# EAGLE schematic Schematic_v4 (EAGLE 9.7.0)
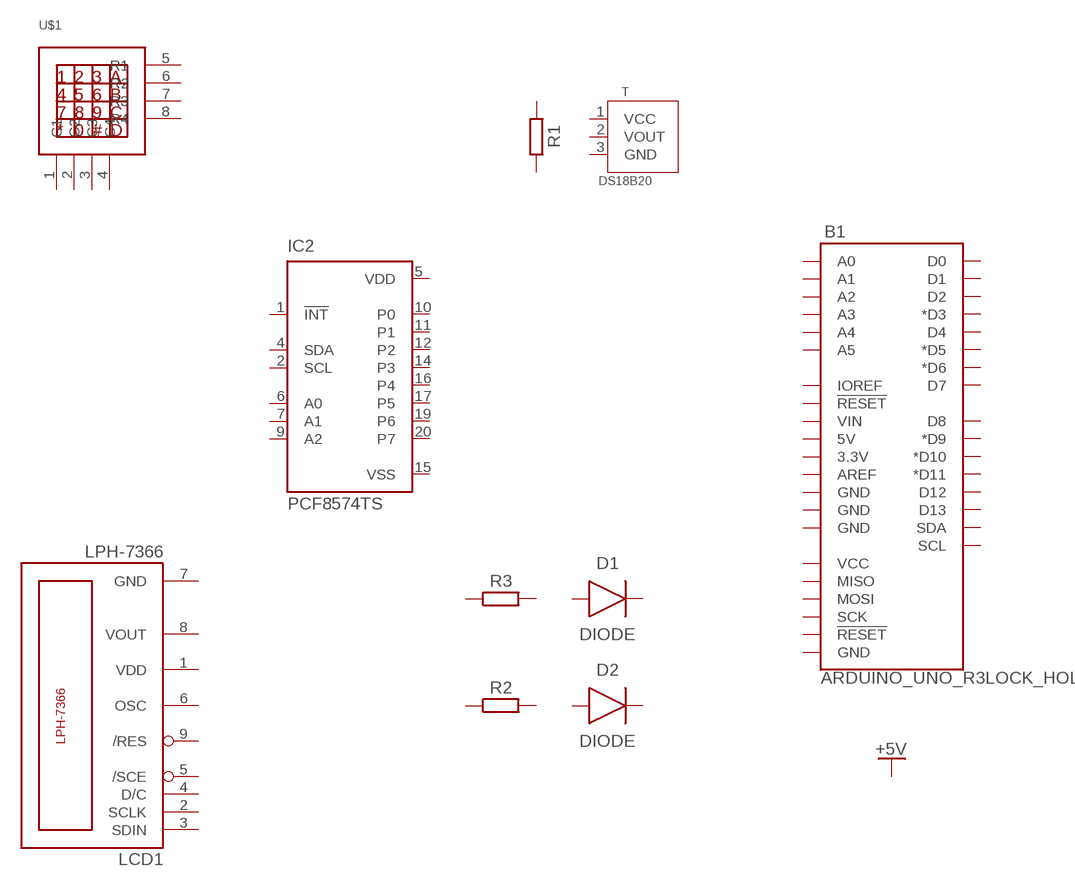
[diagram p0: schematic, sheet 1]

## Parts
B1  ARDUINO_UNO_R3LOCK_HOLES  [ARDUINO_R3_LOCK_HOLES]
D1  DIODE  DIODEDO-214AB(SMC)  [DIOM7959X625N]
D2  DIODE  DIODEDO-214AB(SMC)  [DIOM7959X625N]
IC2  PCF8574TS  [SSOP20]
LCD1  LPH-7366  [LPH-7366]
R1  R_AXIAL-7.2MM-PITCH  [RESAD724W46L381D178B]
R2  R_AXIAL-7.2MM-PITCH  [RESAD724W46L381D178B]
R3  R_AXIAL-7.2MM-PITCH  [RESAD724W46L381D178B]
T  DS18B20  A1324LLHLT-TLH  [SOT95P285X113-3N]
U$1  KEYPAD4X4  [KEYPAD4X4]
Unconnected: B1.3.3V B1.5V B1.A0 B1.A1 B1.A2 B1.A3 B1.A4 B1.A5 B1.AREF B1.D0 B1.D1 B1.D2 B1.D3(*D3) B1.D4 B1.D5(*D5) B1.D6(*D6) B1.D7 B1.D8 B1.D9(*D9) B1.D10(*D10) B1.D11(*D11) B1.D12 B1.D13 B1.GND@1(GND) B1.GND@2(GND) B1.GND@3(GND) B1.GND@4(GND) B1.IOREF B1.MISO B1.MOSI B1.RESET@1(!RESET!) B1.RESET@2(!RESET!) B1.SCK B1.SCL B1.SDA B1.VCC B1.VIN D1.1(C) D1.2(A) D2.1(C) D2.2(A) IC2.1(!INT) IC2.2(SCL) IC2.4(SDA) IC2.6(A0) IC2.7(A1) IC2.9(A2) IC2.10(P0) IC2.11(P1) IC2.12(P2) IC2.14(P3) IC2.16(P4) IC2.17(P5) IC2.19(P6) IC2.20(P7) LCD1.2(SCLK) LCD1.3(SDIN) LCD1.4(D/C) LCD1.5(/SCE) LCD1.6(OSC) LCD1.8(VOUT) LCD1.9(/RES) R1.1 R1.2 R2.1 R2.2 R3.1 R3.2 T.2(VOUT) T.3(GND) U$1.1(C1) U$1.2(C2) U$1.3(C3) U$1.4(C4) U$1.5(R1) U$1.6(R2) U$1.7(R3) U$1.8(R4)

## Power pins joined to a net without a drawn wire
GND: LCD1.7(GND)
VCC: T.1(VCC)
VDD: IC2.5(VDD) LCD1.1(VDD)
VSS: IC2.15(VSS)

## Library data of the parts
B1 = SparkFun-Boards:ARDUINO_UNO_R3: Arduino R3 Footprint with SPI header Arduino Uno R3 Compatible Footprint. Matches PCB size of the original board. SparkFun Products: SAMD21 Dev Breakout <https://www.sparkfun.com/products/13672> RedBoard <https://www.sparkfun.com/products/12757> R3 Stackable Headers <https://www.sparkfun.com/products/11417>
D1 D2 = Diode:DIODE: Diode Rectifier - Generic; CATEGORY: Diode; SUB-CATEGORY: Rectifier
IC2 = micro-philips (1):PCF8574: I2C-Bus Remote 8-bit I/O expander http://www.semiconductors.philips.com/acrobat_download/datasheets/PCF8574_4.pdf
LCD1 = lph-7366:LPH-7366
R1-R3 = Resistor:R: Resistor Fixed - Generic; CATEGORY: Resistor; SUB-CATEGORY: Fixed
T = Sensor:A1324LLHLT-T: SENSOR HALL EFFECT ANALOG SOT23W; CATEGORY: Sensor; MANUFACTURER: Allegro microsystems; MPN: DS18B20; OPERATING_TEMP: -40 to 150 °C; PART_STATUS: Active; ROHS_COMPLIANT: RoHS3 Compliant; SUB-CATEGORY: Magnetic; VALUE: A1324LLHLT
U$1 = keypad_4x4_raw:KEYPAD4X4